# Altium schematic sheet temp_presX3.SchDoc
size A
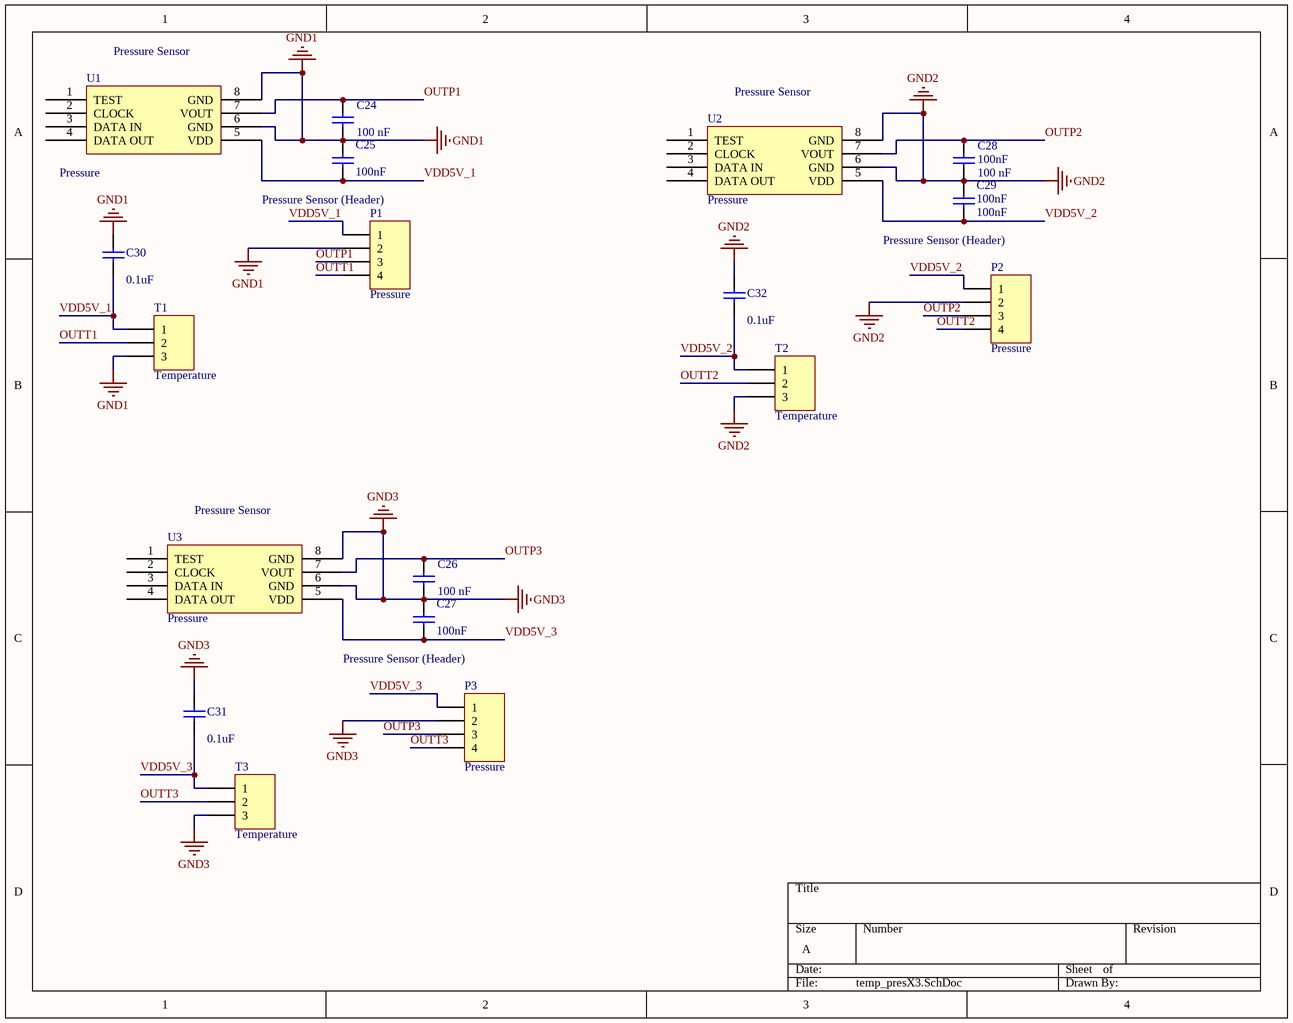
[diagram p0: temp_presX3.SchDoc]

## Parts
C24  value 100 nF  [C1206]  (hidden comment: 100nF)
C25  100nF  [C1206]
C26  value 100 nF  [C1206]  (hidden comment: 100nF)
C27  100nF  [C1206]
C28  100nF  value 100 nF  [C1206]
C29  100nF  [C1206]
C30  0.1uF  [C1206]
C31  0.1uF  [C1206]
C32  0.1uF  [C1206]
P1  Pressure  [HDR1X4]
P2  Pressure  [HDR1X4]
P3  Pressure  [HDR1X4]
T1  Temperature  [HDR1X3]
T2  Temperature  [HDR1X3]
T3  Temperature  [HDR1X3]
U1  Pressure  [KP-234]
U2  Pressure  [KP-234]
U3  Pressure  [KP-234]

## Nets
GND1: C24.1 C25.2 C30.2 P1.2 T1.3 U1.6(GND) U1.8(GND)
GND2: C28.1 C29.2 C32.2 P2.2 T2.3 U2.6(GND) U2.8(GND)
GND3: C26.1 C27.2 C31.2 P3.2 T3.3 U3.6(GND) U3.8(GND)
OUTP1: C24.2 P1.3 U1.7(VOUT)
OUTP2: C28.2 P2.3 U2.7(VOUT)
OUTP3: C26.2 P3.3 U3.7(VOUT)
OUTT1: P1.4 T1.2
OUTT2: P2.4 T2.2
OUTT3: P3.4 T3.2
VDD5V_1: C25.1 C30.1 P1.1 T1.1 U1.5(VDD)
VDD5V_2: C29.1 C32.1 P2.1 T2.1 U2.5(VDD)
VDD5V_3: C27.1 C31.1 P3.1 T3.1 U3.5(VDD)

Not connected (* = marked no-connect by the designer): U1 1(TEST) 2(CLOCK) 3(DATA_IN) 4(DATA_OUT); U2 1(TEST) 2(CLOCK) 3(DATA_IN) 4(DATA_OUT); U3 1(TEST) 2(CLOCK) 3(DATA_IN) 4(DATA_OUT)

## Notes on the sheet
- (near U1) Pressure Sensor
- (near U2) Pressure Sensor
- Pressure Sensor (Header)
- (near U3) Pressure Sensor

## Library data of the parts
C24-C32 = Cap Semi: Capacitor (Semiconductor SIM Model); Published: 8-Jun-2000; LatestRevisionDate: 29-May-2009; LatestRevisionNote: IPC-7351 Footprint Added.; PackageReference: C1206; Publisher: Altium Limited; PackageDescription: Chip Capacitor
  C25 C27 C29: Value: 100nF
  C30-C32: Value: 0.1uF
P1-P3 = Header 4: Header, 4-Pin; LatestRevisionDate: 17-Jul-2002; LatestRevisionNote: Re-released for DXP Platform.; Publisher: Altium Limited
T1-T3 = Header 3: Header, 3-Pin; LatestRevisionDate: 17-Jul-2002; LatestRevisionNote: Re-released for DXP Platform.; Publisher: Altium Limited
U1-U3 = Component_1